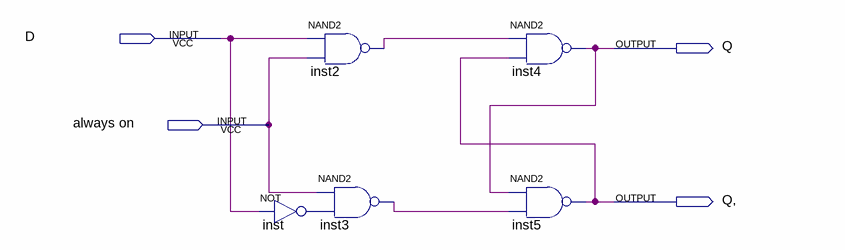
[diagram p0: schematic sheet]
// Quartus schematic 3.bdf as structural Verilog: 5 symbols, 4 pins
module \3  (
  input  D,
  input  \always_on ,
  output Q
);

  wire inst2_out, inst3_out, inst5_out, inst_out;

  not inst (inst_out, D);
  nand inst2 (inst2_out, D, \always_on );
  nand inst3 (inst3_out, \always_on , inst_out);
  nand inst4 (Q, inst2_out, inst5_out);
  nand inst5 (inst5_out, Q, inst3_out);
endmodule
